# EAGLE design Tah Board Ver 1.0 (EAGLE 7.0.0)
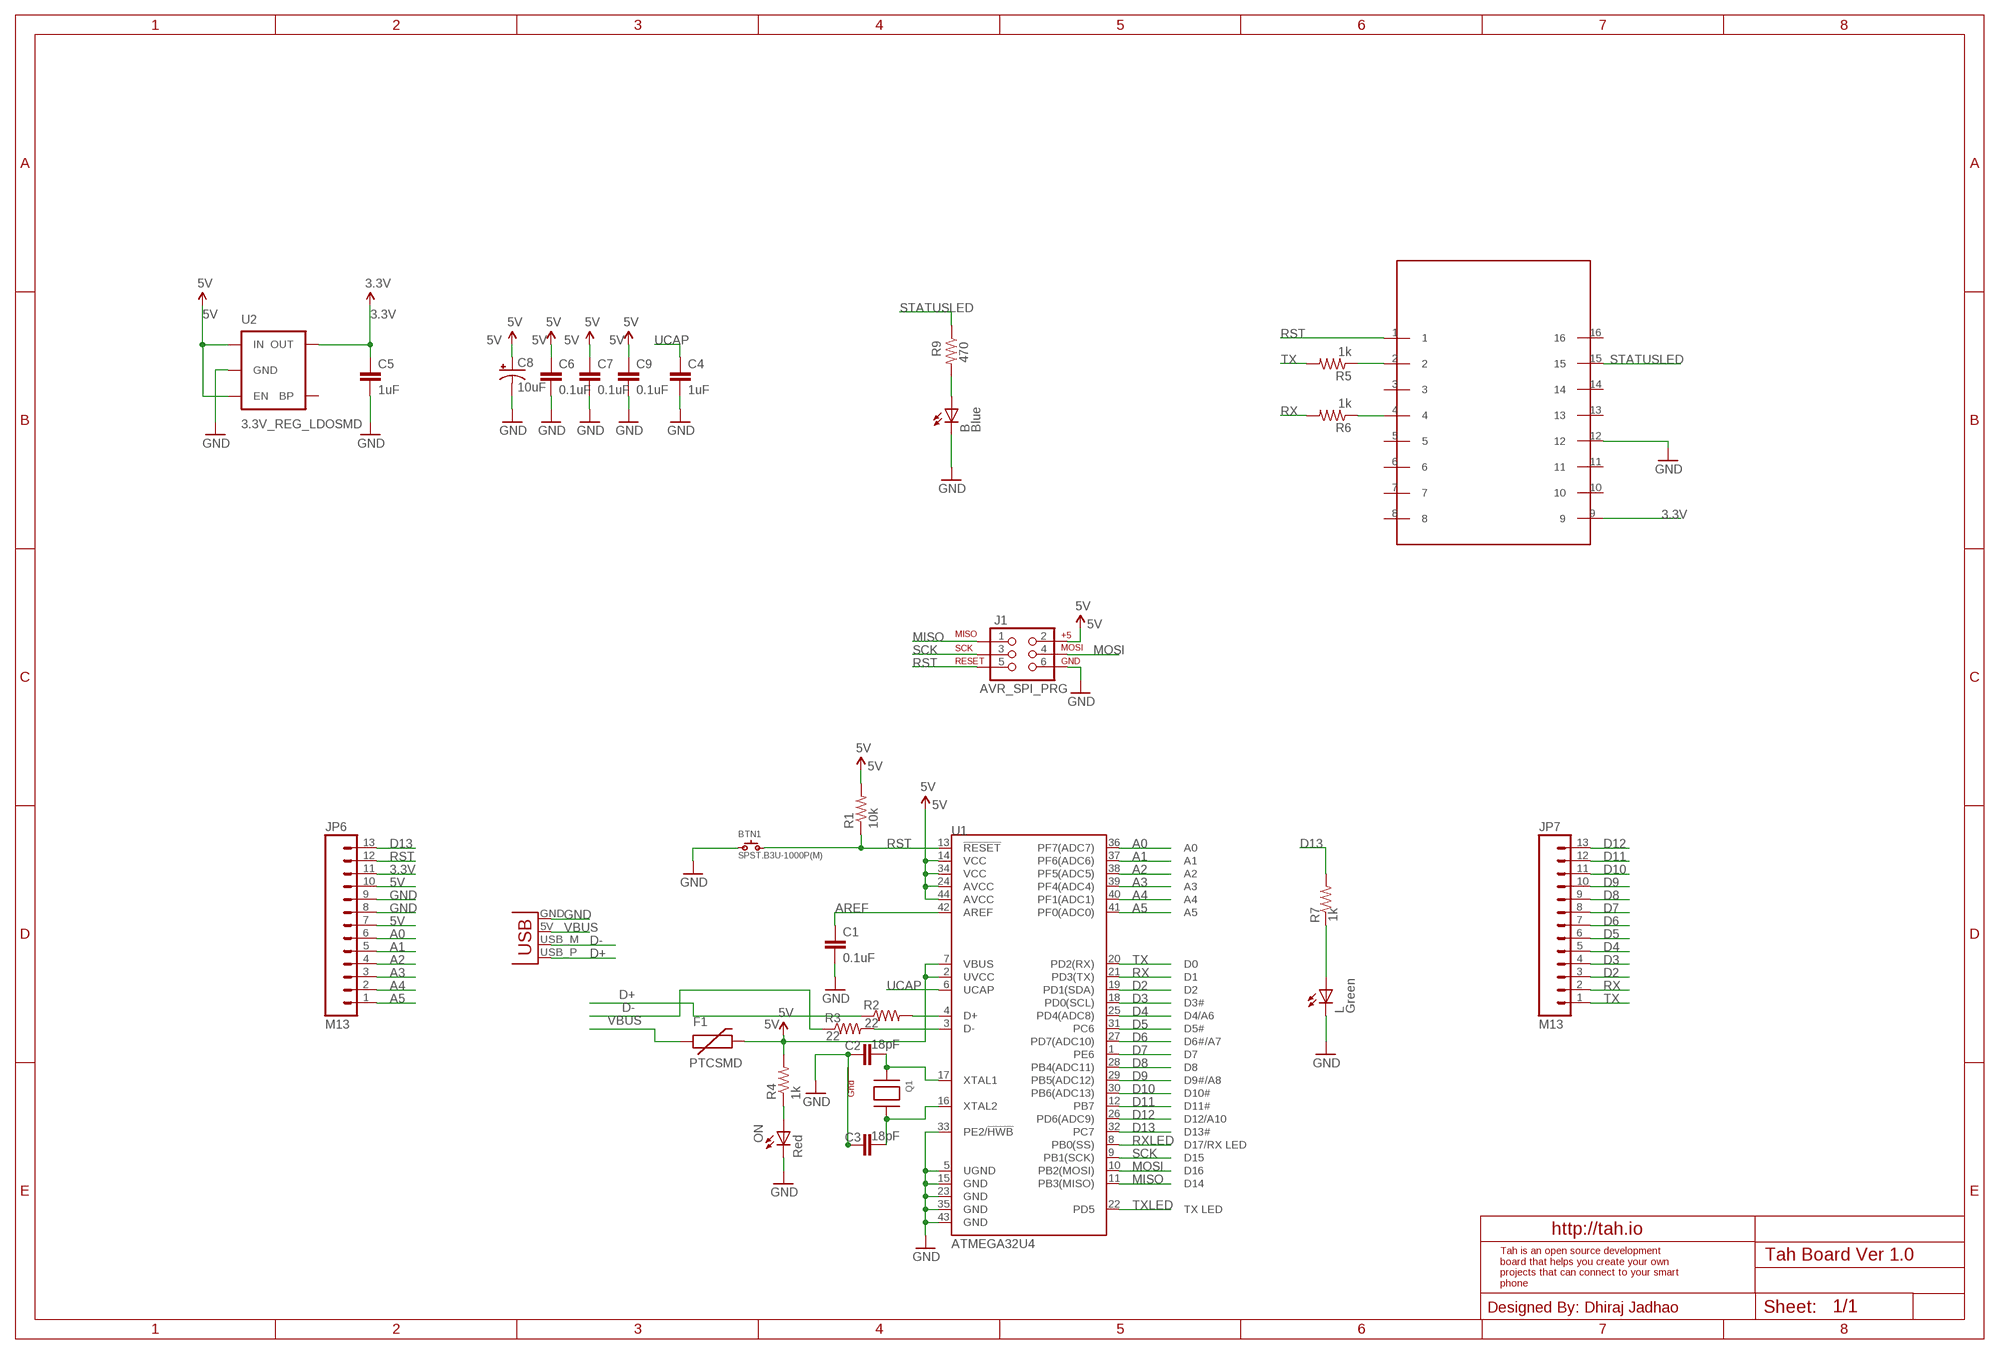
[diagram p0: schematic, sheet 1]

## Parts
B  Blue  LEDSMT1206  [1206]
BLE  HM-11HM11  [BC05B-SMD]
BTN1  SPST.B3U-1000P(M)  [B3U-1000P(M)]
C1  0.1uF  2.2UF-CERCAP-10009  [1206]
C2  18pF  2.2UF-CERCAP-10009  [1206]
C3  18pF  2.2UF-CERCAP-10009  [1206]
C4  1uF  2.2UF-CERCAP-10009  [1206]
C5  1uF  2.2UF-CERCAP-10009  [1206]
C6  0.1uF  2.2UF-CERCAP-10009  [1206]
C7  0.1uF  2.2UF-CERCAP-10009  [1206]
C8  10uF  CAP_POL1206  [EIA3216]
C9  0.1uF  2.2UF-CERCAP-10009  [1206]
F1  PTCSMD  [PTC-1206]
J1  AVR_SPI_PRG  AVR_SPI_PRG_6PTH  [2X3]
JP2  USBPCB  [USB-A-PCB]
JP6  M13  [1X13]
JP7  M13  [1X13]
L  Green  LEDSMT1206  [1206]
ON  Red  LEDSMT1206  [1206]
Q1  XTAL-4-3225  [NX3225]
R1  10k  RESISTOR1206  [1206]
R2  22  RESISTOR1206  [1206]
R3  22  RESISTOR1206  [1206]
R4  1k  RESISTOR1206  [1206]
R5  1k  RESISTOR1206  [1206]
R6  1k  RESISTOR1206  [1206]
R7  1k  RESISTOR1206  [1206]
R9  470  RESISTOR1206  [1206]
U1  ATMEGA32U4  ATMEGA32U4QFN2  [SPARKFUN-DIGITALIC_QFN-44-NOPAD]
U2  3.3V_REG_LDOSMD  V_REG_LDOSMD  [SOT23-5]

## Nets
3.3V: BLE.9 C5.1 JP6.11 U2.5(OUT)
5V: C6.1 C7.1 C8.A(+) C9.1 F1.2 J1.2 JP6.7 JP6.10 R1.2 R4.2 U1.2(UVCC) U1.7(VBUS) U1.14(VCC) U1.24(AVCC) U1.34(VCC) U1.44(AVCC) U2.1(IN) U2.3(EN)
A0: JP6.6 U1.36(PF7(ADC7))
A1: JP6.5 U1.37(PF6(ADC6))
A2: JP6.4 U1.38(PF5(ADC5))
A3: JP6.3 U1.39(PF4(ADC4))
A4: JP6.2 U1.40(PF1(ADC1))
A5: JP6.1 U1.41(PF0(ADC0))
AREF: C1.1 U1.42(AREF)
D2: JP7.3 U1.19(PD1(SDA))
D3: JP7.4 U1.18(PD0(SCL))
D4: JP7.5 U1.25(PD4(ADC8))
D5: JP7.6 U1.31(PC6)
D6: JP7.7 U1.27(PD7(ADC10))
D7: JP7.8 U1.1(PE6)
D8: JP7.9 U1.28(PB4(ADC11))
D9: JP7.10 U1.29(PB5(ADC12))
D10: JP7.11 U1.30(PB6(ADC13))
D11: JP7.12 U1.12(PB7)
D12: JP7.13 U1.26(PD6(ADC9))
D13: JP6.13 R7.2 U1.32(PC7)
D+: JP2.USB_P(D+) R2.1
D-: JP2.USB_M(D-) R3.1
GND: B.C BLE.12 BTN1.1 C1.2 C2.1 C3.1 C4.2 C5.2 C6.2 C7.2 C8.C(-) C9.2 J1.6 JP2.GND JP6.8 JP6.9 L.C ON.C Q1.2(G2) Q1.4(G1) U1.5(UGND) U1.15(GND) U1.23(GND) U1.33(PE2/!HWB) U1.35(GND) U1.43(GND) U2.2(GND)
MISO: J1.1 U1.11(PB3(MISO))
MOSI: J1.4 U1.10(PB2(MOSI))
N$1: L.A R7.1
N$2: C2.2 Q1.1(X1) U1.17(XTAL1)
N$3: C3.2 Q1.3(X2) U1.16(XTAL2)
N$4: BLE.2 R5.1
N$5: BLE.4 R6.1
N$6: R2.2 U1.4(D+)
N$8: R3.2 U1.3(D-)
N$9: ON.A R4.1
N$11: B.A R9.2
RST: BLE.1 BTN1.2 J1.5 JP6.12 R1.1 U1.13(!RESET)
RX: JP7.2 R6.2 U1.21(PD3(TX))
RXLED: U1.8(PB0(SS))
SCK: J1.3 U1.9(PB1(SCK))
STATUSLED: BLE.15 R9.1
TX: JP7.1 R5.2 U1.20(PD2(RX))
TXLED: U1.22(PD5)
UCAP: C4.1 U1.6(UCAP)
VBUS: F1.1 JP2.5V(VBUS)
Unconnected: BLE.3 BLE.5 BLE.6 BLE.7 BLE.8 BLE.10 BLE.11 BLE.13 BLE.14 BLE.16 U2.4(BP)

## Notes on the sheet
- http://tah.io
- Tah is an open source development 
  board that helps you create your own
  projects that can connect to your smart
  phone
- Designed By: Dhiraj Jadhao

## Library data of the parts
B L ON = 1n4148 diode sot 23:LED: LED OSRAM: - CHIPLED LG R971, LG N971, LY N971, LG Q971, LY Q971, LO R971, LY R971 LH N974, LH R974 LS Q976, LO Q976, LY Q976 LO Q996 - Hyper CHIPLED LW Q18S LB Q993, LB Q99A, LB R99A - SideLED LS A670, LO A670, LY A670, LG A670, LP A670 LB A673, LV A673, LT A673, LW A673 LH A674 LY A675 LS A676, LA A676, LO A676, LY A676, LW A676 LS A679, LY A679, LG A679 - Hyper Micro SIDELED® LS Y876, LA Y876, LO Y876, LY Y876 LT Y87S - SmartLED LW L88C, LW L88S LB L89C, LB L89S, LG L890 LS L89K, LO L89K, LY L89K LS L896, LA L896, LO L896, LY L896 - TOPLED LS T670, LO T670, LY T670, LG T670, LP T670 LSG T670, LSP T670, LSY T670, LOP T670, LYG T670 LG T671, LOG T671, LSG T671 LB T673, LV T673, LT T673, LW T673 LH T674 LS T676, LA T676, LO T676, LY T676, LB T676, LH T676, LSB T676, LW T676 LB T67C, LV T67C, LT T67C, LS T67K, LO T67K, LY T67K, LW E67C LS E67B, LA E67B, LO E67B, LY E67B, LB E67C, LV E67C, LT E67C LW T67C LS T679, LY T679, LG T679 LS T770, LO T770, LY T770, LG T770, LP T770 LB T773, LV T773, LT T773, LW T773 LH T774 LS E675, LA E675, LY E675, LS T675 LS T776, LA T776, LO T776, LY T776, LB T776 LHGB T686 LT T68C, LB T68C - Hyper Mini TOPLED® LB M676 - Mini TOPLED Santana® LG M470 LS M47K, LO M47K, LY M47K Source: http://www.osram.convergy.de/
BLE = HM-11:HM-11
BTN1 = omron:SPST
C1-C7 C9 = SparkFun-Capacitors:2.2UF-CER: 2.2uF Ceramic SMT CAP-07888- 10V, 20% (0603) CAP-10009- 50V, 10% (1206); PROD_ID: CAP-10009; VALUE: 2.2uF
C8 = SparkFun:CAP_POL: Capacitor Polarized These are standard SMD and PTH capacitors. Normally 10uF, 47uF, and 100uF in electrolytic and tantalum varieties. Always verify the external diameter of the through hole cap, it varies with capacity, voltage, and manufacturer. The EIA devices should be standard.
F1 = SparkFun:PTC: Resettable Fuse PTC Resettable Fuse. Spark Fun Electronics SKU : COM-08357
J1 = SparkFun:AVR_SPI_PRG_6: AVR ISP 6 Pin This is the reduced ISP connector for AVR programming. Common on Arduino. This footprint will take up less PCB space and can be used with a 10-pin to 6-pin adapter such as SKU: BOB-08508
JP2 = SparkFun-Connectors:USB: USB Connectors USB-B-PTH is fully proven SKU : PRT-00139/CONN-08278 USB-miniB is fully proven SKU : PRT-00587 USB-A-PCB is untested. USB-A-H is throughly reviewed, but untested. Spark Fun Electronics SKU : PRT-00437 USB-B-SMT is throughly reviewed, but untested. Needs silkscreen touching up. USB-A-S has not been used/tested USB-MB-H has not been used/tested USB-MICROB has been used. CONN-09505
JP6 JP7 = SparkFun-Connectors:M13: 13-pin single row .1" header
Q1 = adafruit:XTAL-4: Classic 4-pin 3.2 x 2.5mm crystal
R1-R7 R9 = SparkFun-Resistors:RESISTOR: Resistor Basic schematic elements and footprints for 0603, 1206, and PTH resistors.
U1 = SparkFun-Retired:ATMEGA32U4: Atmel 44-pin 8-bit Microcontroller with 32KBytes of ISP Flash and USB Controller ----- Please use the QFN-44-NOPAD_1:1 package for the footprint of all boards using a 32U4. Route traces directly away from the pads as much as possible.
U2 = SparkFun:V_REG_LDO: Voltage Regulator LDO Standard 150mA LDO voltage regulator in SOT-23 layout. Micrel part MIC5205. BP (by-pass) pin is used to lower output noise with 470pF cap.

## Net classes
0 default: clearance 0.355 mm

## Board
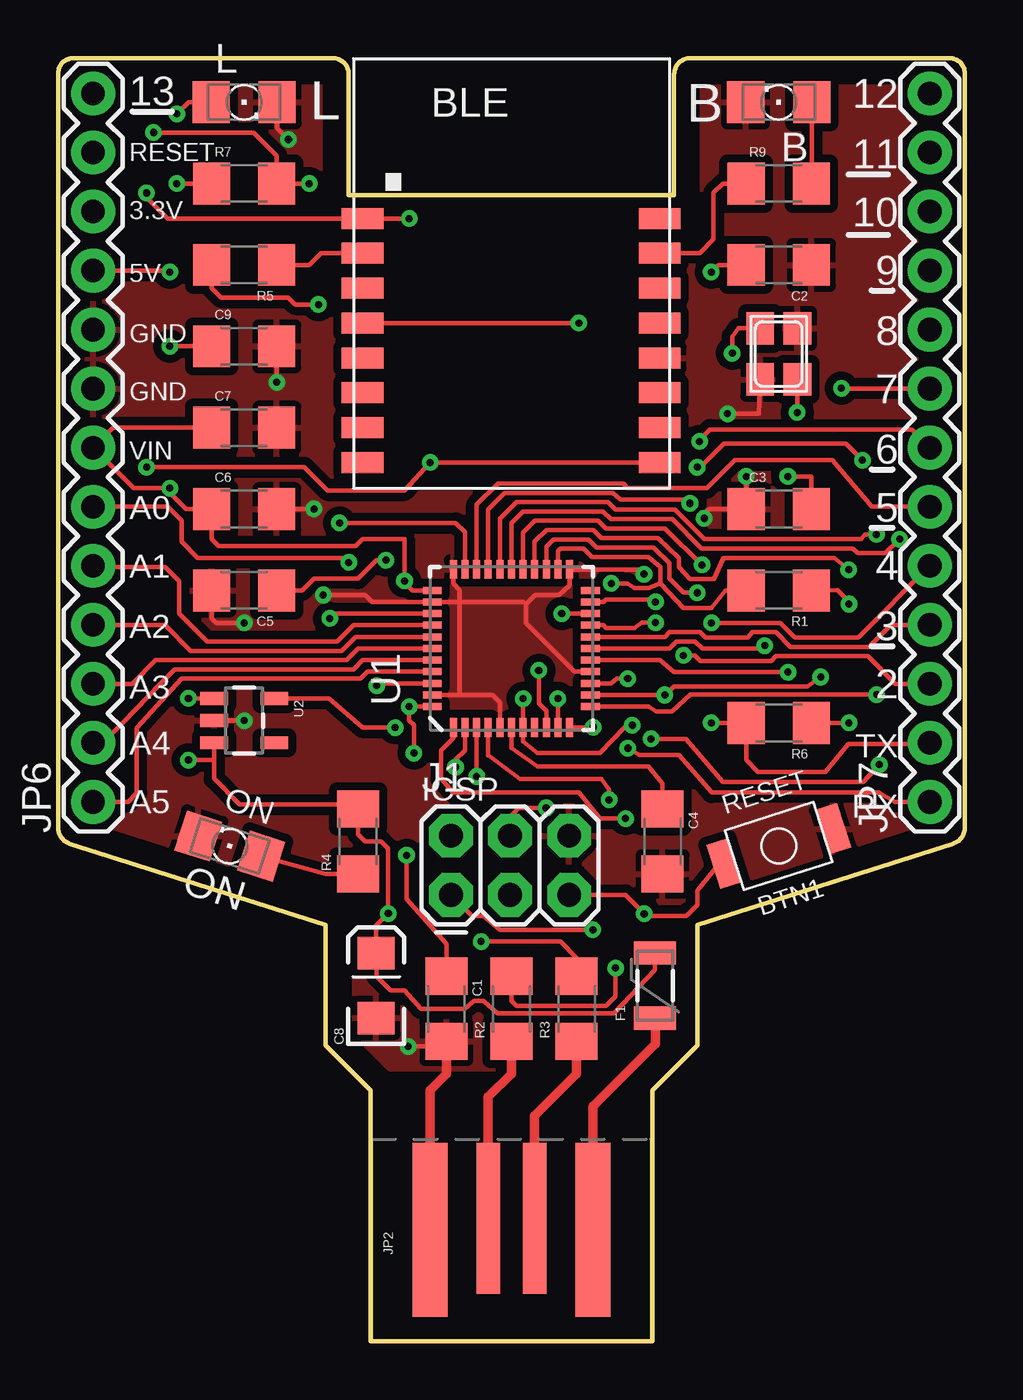
[diagram p1: board, top side]
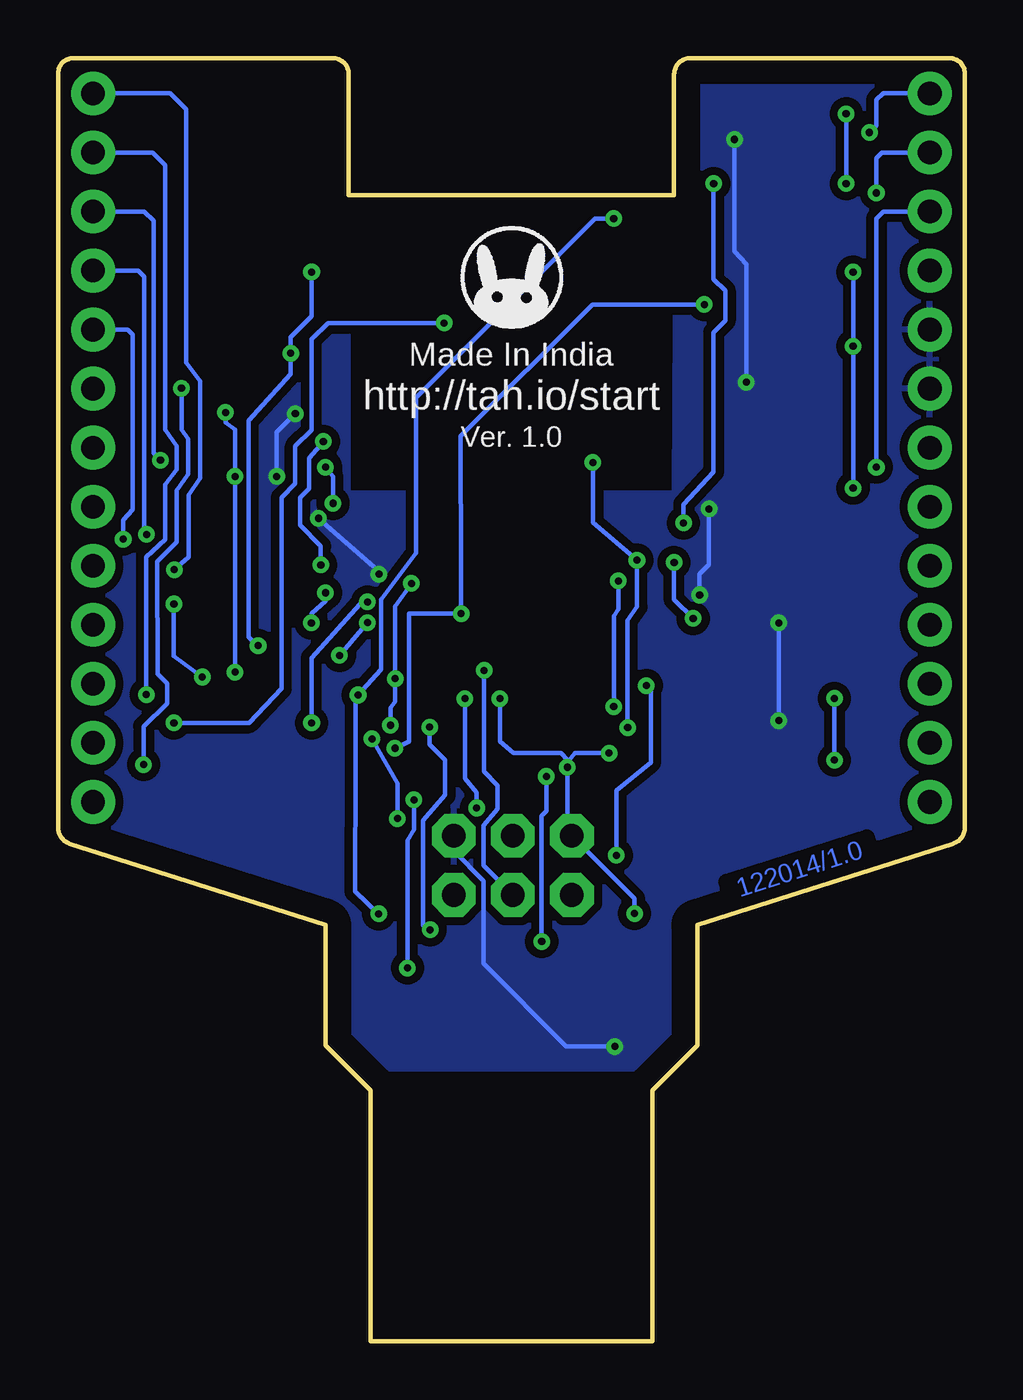
[diagram p2: board, bottom side, seen from below]

Size 39.01 x 55.21 mm. Coordinates in mm from the lower left corner, seen from the top.
Outline: 27.51,17.88 27.51,12.74 25.57,10.8 25.57,0 13.45,0 13.45,10.8 11.51,12.74 11.51,17.88
Outline: 39.01,22.14 39.01,54.51 arc90 38.41,55.21 27.21,55.21 arc90 26.51,54.51 26.51,49.31 12.51,49.31 12.51,54.51 arc90 11.81,55.21 0.61,55.21 arc90 0.01,54.51 0.01,22.14
Outline: 11.51,17.91 0.51,21.41 arc-81 0.01,22.21
Outline: 27.51,17.91 38.51,21.41 arc81 39.01,22.21
Copper layers (1*16): Top 0.035mm / dielectric 1.5mm / Bottom 0.035mm
Design rules "default": minimum track width 10mil, minimum drill 24mil, track to track 8mil, track to pad 8mil, pad to pad 8mil, via to via 8mil, smd to smd 8mil, copper to edge 40mil, drill to drill 8mil, minimum pad ring 10mil, minimum via ring 8mil, stop-mask expansion 4mil, vias tented up to drill 0mil, thermal gap 10mil

### Footprints (pad centres in the part's own frame; a part is rotated, then mirrored left to right if it is on the bottom)
1206 = smd 1.6 x 1.803: A -1.422,0; C 1.422,0
BC05B-SMD = smd 1.8 x 0.9: 1 -6.4,3.4; 2 -6.4,1.9; 3 -6.4,0.4; 4 -6.4,-1.1; 5 -6.4,-2.6; 6 -6.4,-4.1; 7 -6.4,-5.6; 8 -6.4,-7.1; 9 6.38,-7.1; 10 6.38,-5.6; 11 6.38,-4.1; 12 6.38,-2.6; 13 6.38,-1.1; 14 6.38,0.4; 15 6.38,1.9; 16 6.38,3.4
B3U-1000P(M) = smd 1 x 2: 1 -2.45,0; 2 2.45,0
1206' = smd 1.6 x 1.8: 1 -1.4,0; 2 1.4,0
EIA3216 = smd 1.4 x 1.6: A 1.4,0; C -1.4,0
PTC-1206 = smd 1 x 1.8: 1 -1.4,0; 2 1.4,0
2X3 = drill 1.016 pad 1.88 octagon: 1 0,0; 2 0,2.54; 3 2.54,0; 4 2.54,2.54; 5 5.08,0; 6 5.08,2.54
USB-A-PCB = smd 7.5 x 1.5: 5V -0.2,-3.5; GND -0.2,3.5 | smd 6.5 x 1: USB_M 0.3,-1; USB_P 0.3,1
1X13 = drill 1.016 pad 1.88: 1 0,0; 2 2.54,0; 3 5.08,0; 4 7.62,0; 5 10.16,0; 6 12.7,0; 7 15.24,0; 8 17.78,0; 9 20.32,0; 10 22.86,0; 11 25.4,0; 12 27.94,0; 13 30.48,0
NX3225 = smd 1.4 x 1.2: 1 -1.1,-0.8; 2 1.1,-0.8; 3 1.1,0.8; 4 -1.1,0.8
SPARKFUN-DIGITALIC_QFN-44-NOPAD = smd 0.8 x 0.3: 1 -3.4,2.5; 2 -3.4,2; 3 -3.4,1.5; 4 -3.4,1; 5 -3.4,0.5; 6 -3.4,0; 7 -3.4,-0.5; 8 -3.4,-1; 9 -3.4,-1.5; 10 -3.4,-2; 11 -3.4,-2.5; 23 3.4,-2.5; 24 3.4,-2; 25 3.4,-1.5; 26 3.4,-1; 27 3.4,-0.5; 28 3.4,0; 29 3.4,0.5; 30 3.4,1; 31 3.4,1.5; 32 3.4,2; 33 3.4,2.5 | smd 0.3 x 0.8: 12 -2.5,-3.4; 13 -2,-3.4; 14 -1.5,-3.4; 15 -1,-3.4; 16 -0.5,-3.4; 17 0,-3.4; 18 0.5,-3.4; 19 1,-3.4; 20 1.5,-3.4; 21 2,-3.4; 22 2.5,-3.4; 34 2.5,3.4; 35 2,3.4; 36 1.5,3.4; 37 1,3.4; 38 0.5,3.4; 39 0,3.4; 40 -0.5,3.4; 41 -1,3.4; 42 -1.5,3.4; 43 -2,3.4; 44 -2.5,3.4
SOT23-5 = smd 0.55 x 1.2: 1 -0.95,-1.3; 2 0,-1.3; 3 0.95,-1.3; 4 0.95,1.3; 5 -0.95,1.3

### Placement (x,y rotation side)
B  31.01,53.31 180 top
BLE  19.51,44.91 0 top
BTN1  31.01,21.31 197.7 top
C1  0.1uF  [1206']  16.71,14.31 270 top
C2  18pF  [1206']  31.01,46.31 180 top
C3  18pF  [1206']  31.01,35.81 0 top
C4  1uF  [1206']  26.01,21.51 270 top
C5  1uF  [1206']  8.01,32.31 180 top
C6  0.1uF  [1206']  8.01,35.81 0 top
C7  0.1uF  [1206']  8.01,39.31 0 top
C8  13.69,15.31 90 top
C9  0.1uF  [1206']  8.01,42.81 0 top
F1  25.69,15.31 90 top
J1  16.91,19.21 0 top
JP2  19.51,5 90 top
JP6  1.51,23.21 90 top
JP7  37.51,23.21 90 top
L  8.01,53.31 0 top
ON  7.39,21.31 162.3 top
Q1  31.01,42.48 270 top
R1  10k  [1206']  31.01,32.31 180 top
R2  22  [1206']  19.51,14.31 90 top
R3  22  [1206']  22.31,14.31 90 top
R4  1k  [1206']  12.91,21.51 90 top
R5  1k  [1206']  8.01,46.31 180 top
R6  1k  [1206']  31.01,26.61 180 top
R7  1k  [1206']  8.01,49.81 0 top
R9  470  [1206']  31.01,49.81 0 top
U1  19.51,29.81 90 top
U2  8.01,26.71 270 top
U$1  [TAHLOGO]  19.51,45.81 0 bottom

### Tracks (layer width: path | path; a pad name or v marks a point on that pad's centre or on a via)
3.3V  (via drill 0.3 pad 0.2)
  Top 0.203: BLE.9 v16.01,37.81 14.91,36.61 11.6,36.61 10.59,37.61 v3.81,37.61 | v14.11,33.61 13.71,33.61 12.91,32.81 11.01,32.81 10.51,32.31 C5.1 | U2.5 11.67,27.66 13.11,26.41 v14.51,26.41
  Bottom 0.203: v16.01,37.81 16.01,35.24 v14.11,33.61 14.11,31.61 14.51,31.01 v14.51,26.41 | JP6.11 3.51,48.61 3.81,48.31 v3.81,37.61
5V  (via drill 0.3, 0.3 pad 0.2)
  Top 0.203: U1.34 15.25,32.31 14.91,32.66 v14.91,32.72 14.91,34.51 13.11,34.51 12.81,34.21 6.91,34.21 6.61,34.51 C6.1 5.51,35.81 4.81,36.51 v4.81,36.71 3.25,36.71 JP6.7 2.37,39.31 C7.1 | U1.14 23.78,28.31 24.04,28.51 v24.51,28.51 | U1.2 17.51,25.41 17.1,25.03 v17.1,24.7 | F1.2 25.69,15.99 23.91,14.11 18.91,14.11 18.3,14.64 17.89,14.64 17.48,14.31 15.61,14.31 14.91,15.11 14.31,15.11 13.71,15.71 13.71,16.69 C8.A 13.69,17.89 v14.21,18.41 14.21,21.21 13.91,21.51 13.21,21.51 12.91,21.81 R4.2 12.71,23.11 7.81,23.11 6.71,24.21 6.71,25.11 | U2.3 6.71,25.11 | U1.24 21.51,34.01 21.61,34.11 22.61,34.11 22.97,33.74 25.41,33.74 25.91,33.31 25.91,32.61 | 25.91,32.61 26.91,31.56 28.1,31.56 28.71,32.31 R1.2 | JP6.10 4.75,46.07 v4.81,46.01 | v4.81,42.82 5.21,42.81 C9.1 | U2.1 v5.61,27.66 | v5.61,25.01 6.61,25.01 6.71,25.11 | v23.81,32.61 24.51,32.61 24.8,32.41 25.41,32.41 25.9,32.61 25.91,32.61 | 15.71,27.31 U1.44 v15.11,27.31 15.11,26.71 15.31,26.51 v15.31,25.31 | v24.71,26.51 24.47,26.51 24.39,26.43 23.32,25.32 20.62,25.32 20.01,25.82 U1.7 v20.01,27.65
  Bottom 0.203: v14.21,18.41 14.21,19.05 J1.2 17.1,21.94 v17.1,24.7 17.1,24.9 | v4.81,46.01 v4.81,42.82 v4.81,36.71 | v5.61,27.66 v5.61,25.01 | v23.81,32.61 24.51,31.61 v24.51,28.51 24.51,27.53 24.71,27.24 v24.71,26.51 | v15.31,25.31 16.77,25.31 17.1,24.9 | v20.01,27.65 20.01,25.82 19.41,25.31 17.38,25.31 17.1,25.01 17.1,24.9 | v15.11,27.31 15.11,31.21 14.91,31.51 v14.91,32.72
A0  (via drill 0.3 pad 0.2)
  Top 0.203: U1.36 11.89,31.31 v11.69,31.1 | v12.51,33.51 12.31,33.71 6.01,33.71 5.31,34.41 5.31,35.31 4.71,35.91 JP6.6
  Bottom 0.203: v11.69,31.1 12.51,31.91 v12.51,33.51
A1
  Top 0.203: U1.37 12.71,30.81 12.01,30.11 6.41,30.11 5.21,31.31 5.21,32.71 4.61,33.31 1.55,33.31 JP6.5
A2
  Top 0.203: U1.38 12.81,30.31 12.21,29.71 5.71,29.71 4.61,30.81 1.53,30.81 JP6.4
A3
  Top 0.203: JP6.3 3.19,28.29 4.21,29.31 12.41,29.31 12.91,29.81 U1.39
A4
  Top 0.203: JP6.2 1.92,25.75 2.78,26.61 4.41,28.31 5.01,28.91 12.71,28.91 13.11,29.31 U1.40
A5
  Top 0.203: JP6.1 3.01,23.21 3.39,23.6 3.39,26.38 5.31,28.51 13.01,28.51 13.31,28.81 U1.41
AREF  (via drill 0.3 pad 0.2)
  Top 0.203: C1.1 16.71,16.71 16.71,17.11 16.72,17.11 14.99,19.03 v14.99,20.91 | v13.71,28.21 13.81,28.31 U1.42
  Bottom 0.203: v14.99,20.91 14.99,23.71 13.51,24.91 13.51,28.01 v13.71,28.21
D2  (via drill 0.3 pad 0.2)
  Top 0.203: JP7.3 36.03,28.29 34.84,29.48 30.89,29.48 30.69,29.27 27.64,29.27 27.41,29.51 v26.91,29.51 | v25.71,30.92 25.11,30.92 24.8,30.7 23.58,30.7 23.47,30.81 U1.19
  Bottom 0.203: v26.91,29.51 v25.71,30.92
D3
  Top 0.203: JP7.4 35.83,30.83 34.88,29.88 31.5,29.88 30.88,30.51 29.88,30.51 29.67,30.29 27.85,30.29 27.63,30.51 26.31,30.51 26.11,30.31 U1.18
D4  (via drill 0.3 pad 0.2)
  Top 0.203: U1.25 21.01,34.2 21.31,34.51 22.82,34.51 23.17,34.15 25.61,34.15 26.31,33.49 26.31,32.81 26.91,32.21 v27.51,32.21 | v28.12,30.91 31.09,30.91 31.71,30.29 34.43,30.29 JP7.5
  Bottom 0.203: v27.51,32.21 27.51,31.85 28.12,31.31 v28.12,30.91
D5
  Top 0.203: U1.31 18.01,35.99 18.92,36.91 24.32,36.91 24.5,36.71 27.91,36.71 29.11,37.91 33.3,37.91 35,35.91 JP7.6
D6  (via drill 0.3 pad 0.2)
  Top 0.203: U1.27 20.01,34.8 20.51,35.31 23.24,35.31 23.58,34.96 26.12,34.96 v27.71,33.41 | v27.6,38.72 27.6,38.78 28.05,39.23 36.73,39.23 JP7.7
  Bottom 0.203: v27.71,33.41 27.71,34.21 28.61,35.11 28.61,36.3 28.21,36.7 28.21,38.01 v27.6,38.72
D7  (via drill 0.3 pad 0.2)
  Top 0.203: JP7.8 33.93,40.99 v33.71,41.01 | U1.1 17.01,25.95 16.47,25.41 16.47,24.21 17,23.61 22.4,23.61 23.31,22.5 24.11,22.5 v24.41,22.49 | v25.51,25.92 27.01,25.92 28.61,24.07 34.65,24.07 v35.34,24.82
  Bottom 0.203: v33.71,41.01 33.71,39.22 33.41,38.82 33.41,37.31 33.91,36.61 33.91,34.39 34.75,33.54 34.72,28.71 34.32,28.31 34.32,27.45 35.34,26.46 v35.34,24.82 | v24.41,22.49 24.41,24.01 v25.51,25.92
D8  (via drill 0.3 pad 0.2)
  Top 0.203: U1.28 19.51,35.2 20.01,35.71 23.45,35.71 23.78,35.37 26.42,35.37 27.68,34.11 34.2,34.11 34.4,33.91 35.6,33.91 v36.21,34.51
  Bottom 0.203: JP7.9 36.03,43.53 35.81,43.31 35.81,35.78 36.21,35.33 v36.21,34.51
D9  (via drill 0.3 pad 0.2)
  Top 0.203: U1.29 19.01,35.4 19.72,36.11 23.65,36.11 23.99,35.78 26.54,35.78 27.81,34.51 34.55,34.51 34.71,34.71 v35.21,34.71
  Bottom 0.203: JP7.10 35.57,46.07 35.31,45.81 35.31,34.81 v35.21,34.71
D10  (via drill 0.3 pad 0.2)
  Top 0.203: U1.30 18.51,35.8 19.22,36.51 23.86,36.51 24.19,36.22 26.91,36.22 v27.19,36.06 | v27.51,37.61 27.65,37.61 28.66,38.62 33.9,38.62 v34.61,37.91
  Bottom 0.203: JP7.11 35.31,48.61 34.91,48.21 34.91,38.21 v34.61,37.91 | v27.19,36.06 27.19,37.21 v27.51,37.61
D11  (via drill 0.3 pad 0.2)
  Top 0.203: v35.22,27.83 27.2,27.83 26.4,27.11 25.75,27.11 25.41,27.31 U1.12
  Bottom 0.203: JP7.12 34.95,51.15 34.41,50.61 34.41,39.22 33.92,38.52 33.92,37.51 34.41,36.87 34.41,34.5 35.22,33.74 v35.22,27.83
D12  (via drill 0.3 pad 0.2)
  Top 0.203: U1.26 20.51,34.4 21.01,34.91 23.03,34.91 23.38,34.56 25.81,34.56 26.71,33.7 26.71,33.31 27.19,32.81 28.23,32.81 28.63,33.71 33.41,33.71 v34.02,33.2
  Bottom 0.203: JP7.13 34.19,53.69 33.51,53.01 33.51,42.12 32.9,41.31 32.91,41.3 32.91,37.15 33.41,36.4 33.41,33.74 v34.02,33.2
D13  (via drill 0.3 pad 0.2)
  Top 0.203: U1.32 17.51,34.81 17.11,35.21 v12.11,35.21 | v4.11,52.01 8.41,52.01 9.41,51.01 R7.2 v10.81,49.81
  Bottom 0.203: JP6.13 3.39,53.69 3.41,53.71 3.51,53.71 3.81,53.41 3.81,52.31 v4.11,52.01 | v10.81,49.81 10.81,45.71 10.31,45.21 10.31,43.91 10.81,43.41 10.81,37.41 12.11,36.01 v12.11,35.21
D+
  Top 0.406: JP2.USB_P 18.51,10.51 19.51,11.51 R2.1
D-
  Top 0.406: JP2.USB_M 20.51,9.71 22.31,11.51 R3.1
GND  (via drill 0.3 pad 0.2)
  Top 0.203: v29.61,37.21 C3.1 28.01,35.81 27.81,35.61 v27.81,35.41 | v28.81,39.91 30.16,39.91 Q1.2 | C6.2 v11.01,35.81 | v11.41,32.11 13.21,32.11 13.51,31.81 U1.35 17.28,31.81 | U2.2 v8.01,26.71 | v8.01,30.91 6.8,30.91 6.61,31.11 C5.2 | U1.23 22.62,33.2 25.04,33.2 v25.21,33.01 | L.C 9.43,52.19 v9.91,51.71 | v9.41,41.26 C9.2 | U1.23 | v15.06,12.69 16.71,12.69 C1.2 | 17.28,31.81 17.28,27.8 | 17.28,27.8 U1.43 | U1.33 17.01,32.59 17.28,32.32 17.28,31.81 | U1.5 19.01,27.49 18.7,27.8 17.28,27.8 | U1.15 22.21,28.81 20.12,30.9 20.12,31.71 | 20.12,31.71 20.53,32.12 21.55,32.12 22,32.53 22,33.16 U1.23 | 17.28,31.81 20.03,31.81 20.12,31.71
  Top 0.406: JP2.GND 16.01,10.81 16.71,11.51 C1.2
  Bottom 0.203: v29.61,37.21 29.61,39.11 v28.81,39.91 | v11.41,32.11 11.41,33.02 11.01,33.42 v11.01,35.81 | v8.01,26.71 v8.01,30.91 | J1.6 21.99,21.09 20.71,19.81 20.71,16.27 17.16,12.69 v15.06,12.69 | v25.21,33.01 25.41,33.31 v27.81,35.41 | v9.91,51.71 9.91,46.9 9.41,46.34 v9.41,41.26
  pour Top: 12.51,55.21 12.51,36.51 26.51,36.51 26.51,55.21 38.41,55.21 arc-90 39.01,54.61 39.01,22.11 arc-53 38.71,21.51 27.51,17.91 27.51,12.71 26.51,11.71 12.51,11.71 11.51,12.71 11.51,17.91 0.81,21.31 arc-2 0.51,21.41 arc-70 0.01,22.11 0.01,54.61 arc-90 0.61,55.21
  pour Bottom: 12.41,55.11 12.51,36.51 26.51,36.51 26.51,55.21 38.41,55.21 arc-90 39.01,54.61 39.01,22.11 arc-53 38.71,21.51 27.51,17.91 27.51,12.71 26.51,11.71 12.51,11.71 11.51,12.71 11.51,17.91 0.81,21.31 arc-2 0.51,21.41 arc-70 0.01,22.11 0.01,54.61 arc-90 0.51,55.11
MISO  (via drill 0.3 pad 0.2)
  Top 0.203: v23.01,17.71 19.01,17.71 18.3,18.31 17.81,18.31 J1.1 | U1.11 23.01,26.41 v23.02,26.43
  Bottom 0.203: v23.02,26.43 23.02,25.67 22.36,25.01 22.36,23.51 23.31,22.41 23.31,17.91 v23.01,17.71
MOSI  (via drill 0.3 pad 0.2)
  Top 0.203: v21,22.95 19.81,22.95 19.41,22.51 19.41,21.79 J1.4 | v21.51,27.65 U1.10
  Bottom 0.203: v21.51,27.65 21.51,24.21 21,23.61 v21,22.95
N$1  (via drill 0.3 pad 0.2)
  Top 0.203: R7.1 v5.11,49.81 | v5.11,52.81 5.61,53.31 L.A
  Bottom 0.203: v5.11,49.81 v5.11,52.81
N$2  (via drill 0.3, 0.3 pad 0.2)
  Top 0.203: U1.17 26.31,29.81 26.61,30.11 27.41,30.11 27.71,29.81 30.28,29.81 v30.41,29.93 | v29.01,42.51 29.01,43.24 29.27,43.58 Q1.1 | C2.2 28.41,46.31 v28.11,46.01
  Bottom 0.203: v30.41,29.93 30.51,30.01 30.81,30.31 30.81,39.61 29.01,41.61 v29.01,42.51 29.01,43.21 28.11,44.11 v28.11,46.01
N$3  (via drill 0.3 pad 0.2)
  Top 0.203: v31.81,39.96 Q1.3 | U1.16 25.9,29.31 26.51,28.81 31.11,28.81 31.11,28.79 v31.4,28.79 | C3.2 32.42,37.21 v31.4,37.21
  Bottom 0.203: v31.4,28.79 31.4,29.61 31.4,30.01 v31.4,37.21 31.4,39.23 31.81,39.54 v31.81,39.96
N$4
  Top 0.203: R5.1 10.81,46.31 11.31,46.81 BLE.2
N$5  (via drill 0.3 pad 0.2)
  Top 0.203: R6.1 v34.03,26.61 | BLE.4 v22.41,43.81
  Bottom 0.203: v34.03,26.61 30.8,26.61 29.41,28.08 29.41,36.31 28.81,36.91 28.81,38.51 28.11,39.21 28.11,43.11 27.41,43.81 v22.41,43.81
N$6  (via drill 0.3, 0.3 pad 0.2)
  Top 0.203: U1.4 18.51,25.61 18.5,25.21 18.5,25.23 19.87,24.19 23.38,24.19 23.71,23.75 v23.71,23.3 | R2.2 19.51,14.65 19.72,14.44 23.58,14.44 23.99,14.85 v23.99,16.07
  Bottom 0.203: v23.71,23.3 23.71,22.03 23.99,21.55 v23.99,16.07
N$8  (via drill 0.3 pad 0.2)
  Top 0.203: U1.3 v18.01,24.3 | v18.2,17.2 21.61,17.2 22.31,16.5 R3.2
  Bottom 0.203: v18.01,24.3 18.01,22.81 18.21,22.61 18.21,17.81 v18.2,17.2
N$9
  Top 0.203: ON.A 9.31,20.71 11.51,20.11 R4.1
N$11
  Top 0.203: B.A 32.43,49.83 R9.2
RST  (via drill 0.3 pad 0.2)
  Top 0.203: U1.13 v26.11,27.81 26.5,28.18 32.24,28.18 v32.81,28.58 | BTN1.2 28.36,20.46 27.51,19.41 27.51,18.78 27.03,18.3 25.32,18.3 v25.22,18.4 24.41,19.21 J1.5 | R1.1 33.54,32.32 34.03,31.82 v34.03,31.72 | v15.11,48.31 BLE.1 4.71,48.31 3.81,49.21 v3.81,49.41
  Bottom 0.203: v25.22,18.4 26.24,19.35 26.21,24.91 26.21,27.71 v26.11,27.81 25.11,28.91 25.11,31.91 23.61,33.91 23.61,40.61 15.91,48.31 v15.11,48.31 | v34.03,31.72 34.03,29.48 v32.81,28.58 | JP6.12 3.57,51.15 3.81,50.91 v3.81,49.41
RX  (via drill 0.3 pad 0.2)
  Top 0.203: JP7.2 37.45,25.71 34.01,25.71 33.01,24.51 30.11,24.51 29.61,25.01 R6.2 v28.11,26.61 | v25.71,31.81 25.61,31.92 23.58,31.92 23.47,31.81 U1.21
  Bottom 0.203: v28.11,26.61 28.11,29.41 26.02,31.71 25.92,31.81 v25.71,31.81
SCK  (via drill 0.3 pad 0.2)
  Top 0.203: U1.9 21.01,27.12 20.68,27.45 v20.68,28.87
  Bottom 0.203: v20.68,28.87 20.68,24.52 20.1,23.92 20.1,22.91 20.71,22.21 20.71,20.47 J1.3
STATUSLED
  Top 0.203: R9.1 28.61,49.81 28.21,49.41 28.21,47.41 27.61,46.81 BLE.15
TX  (via drill 0.3 pad 0.2)
  Top 0.203: U1.20 v21.67,31.31 | JP7.1 36.01,23.21 35.31,23.61 28.13,23.61 26.72,25.22 25.02,25.22 v24.52,25.52 | R5.2 6.61,45.31 7.01,44.91 9.91,44.91 10.21,44.61 v11.21,44.61
  Bottom 0.203: v24.52,25.52 24.49,25.52 23.91,25.82 23.91,31.31 23.78,31.31 v21.67,31.31 21.67,33.11 21.69,38.94 16.02,44.61 v11.21,44.61
UCAP
  Top 0.203: U1.6 19.51,25.53 20.62,24.73 25.41,24.73 26.01,24 C4.1
VBUS
  Top 0.203: 25.71,13.89 F1.1
  Top 0.406: JP2.5V 23.01,10.11 25.71,12.81 25.71,13.89

### Text on the board
Bottom: 122014/1.0
bPlace: Made In India | http://tah.io/start | Ver. 1.0
_tNames: 12 | 13 | L | B | 11 | RESET | 10 | 3.3V | 9 | 5V | 8 | GND | 7 | GND | 6 | VIN | 5 | A0 | 4 | A1 | 3 | A2 | 2 | A3 | TX | A4 | RX | A5 | ON | ICSP | RESET